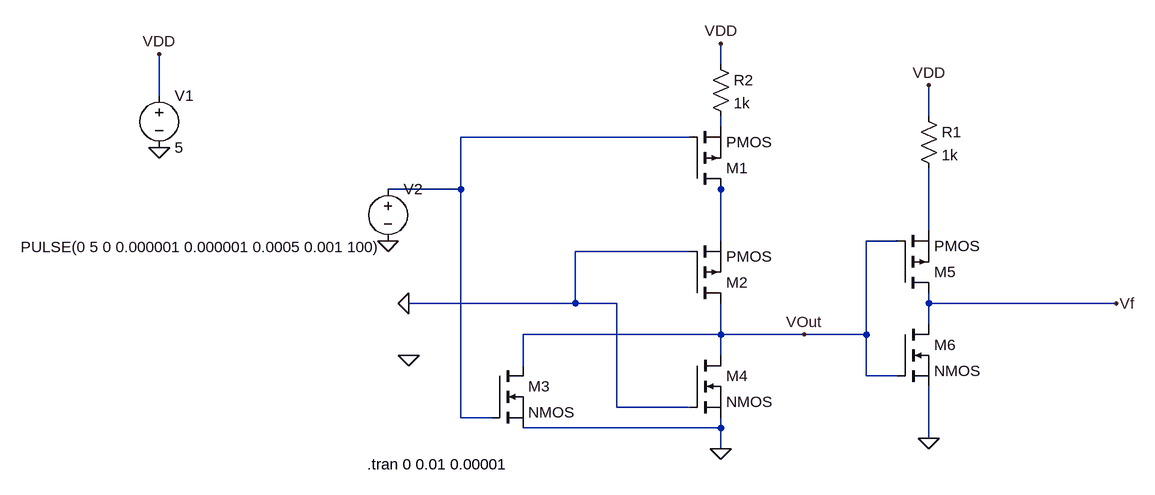
[diagram p0: schematic or_cmos.asc]
or_cmos.asc, the LTspice schematic file:
Version 4
SHEET 1 936 680
WIRE 288 -416 288 -448
WIRE -576 -368 -576 -432
WIRE 608 -336 608 -384
WIRE 288 -320 288 -336
WIRE 240 -304 -112 -304
WIRE -112 -224 -112 -304
WIRE -112 -224 -224 -224
WIRE 288 -224 288 -240
WIRE 608 -160 608 -256
WIRE 288 -144 288 -224
WIRE 560 -144 512 -144
WIRE 240 -128 64 -128
WIRE 64 -48 64 -128
WIRE 64 -48 -192 -48
WIRE 128 -48 64 -48
WIRE 608 -48 608 -64
WIRE 896 -48 608 -48
WIRE 608 -16 608 -48
WIRE 288 0 288 -48
WIRE 288 0 -16 0
WIRE 416 0 288 0
WIRE 512 0 512 -144
WIRE 512 0 416 0
WIRE 288 32 288 0
WIRE -16 48 -16 0
WIRE 512 64 512 0
WIRE 560 64 512 64
WIRE 128 112 128 -48
WIRE 240 112 128 112
WIRE -112 128 -112 -224
WIRE -64 128 -112 128
WIRE 288 144 288 128
WIRE 288 144 -16 144
WIRE 608 160 608 80
WIRE 288 176 288 144
FLAG 288 176 0
FLAG -576 -288 0
FLAG -576 -432 VDD
FLAG 288 -448 VDD
FLAG -224 -144 0
FLAG 416 0 VOut
FLAG -192 32 0
FLAG -192 -48 0
FLAG 608 160 0
FLAG 608 -384 VDD
FLAG 896 -48 Vf
SYMBOL pmos 240 -224 M180
SYMATTR InstName M1
SYMBOL pmos 240 -48 M180
SYMATTR InstName M2
SYMBOL nmos -64 48 R0
SYMATTR InstName M3
SYMBOL nmos 240 32 R0
SYMATTR InstName M4
SYMBOL voltage -576 -384 R0
WINDOW 123 0 0 Left 0
WINDOW 39 0 0 Left 0
SYMATTR InstName V1
SYMATTR Value 5
SYMBOL voltage -224 -240 R0
WINDOW 3 -565 105 Left 2
WINDOW 123 0 0 Left 0
WINDOW 39 0 0 Left 0
SYMATTR Value PULSE(0 5 0 0.000001 0.000001 0.0005 0.001 100)
SYMATTR InstName V2
SYMBOL pmos 560 -64 M180
SYMATTR InstName M5
SYMBOL nmos 560 -16 R0
SYMATTR InstName M6
SYMBOL res 592 -352 R0
SYMATTR InstName R1
SYMATTR Value 1k
SYMBOL res 272 -432 R0
SYMATTR InstName R2
SYMATTR Value 1k
TEXT -256 200 Left 2 !.tran 0 0.01 0.00001

The netlist it stands for:
* or_cmos.asc
M1 N003 N002 N001 N001 PMOS
M2 VOut 0 N003 N003 PMOS
M3 VOut N002 0 0 NMOS
M4 VOut 0 0 0 NMOS
V1 VDD 0 5
V2 N002 0 PULSE(0 5 0 0.000001 0.000001 0.0005 0.001 100)
M5 Vf VOut N004 N004 PMOS
M6 Vf VOut 0 0 NMOS
R1 VDD N004 1k
R2 VDD N001 1k
.model NMOS NMOS
.model PMOS PMOS
.lib standard.mos
.tran 0 0.01 0.00001
.backanno
.end